# Altium project NXP_FRDM_IMX93.PrjPcb (part 11 of 13)

## Sheet E-20 EXP_MicroSD_ADC.SchDoc: FRDM-IMX93
size 513 x 386 mm; DrawnBy: FORLINX; Organization: ORGANIZATION; Address1: ADDRESS 1; Address2: ADDRESS 2; Address3: ADDRESS 3; Address4: ADDRESS 4; Revision: -; ENG_APP_DATE: --/--/--; DSN_APP_DATE: --/--/--; CHK_APP_DATE: --/--/--; Classification: Public, Company Internal/Proprietary, Company Confidential,  Company Secret; Page Create Date: March  8, 1995; OrgName: NXP Semiconductor; FIUO: A; OrgAddr1: NO. 192 Liangjing Rd. Pudong New Area, ShangHai; Page Number: 20; PageTitle: EXP/MicroSD/ADC; Page Size: C; Page Count: 23; Designer: FORLINX; RevCode: B1; Approver: NXP SE; Doc: SCH-94611 PDF: SPF-94611; DsnPath: T:\FILES\Designs\Single Board Computers\i.MX93-FRDM\Design Files\SCH-94611_B1.DSN; SchematicName: FRDM-i.MX 93 Development Board; PageName: E-20 EXP/MicroSD/ADC; PageSize: C; TopSchematic: True
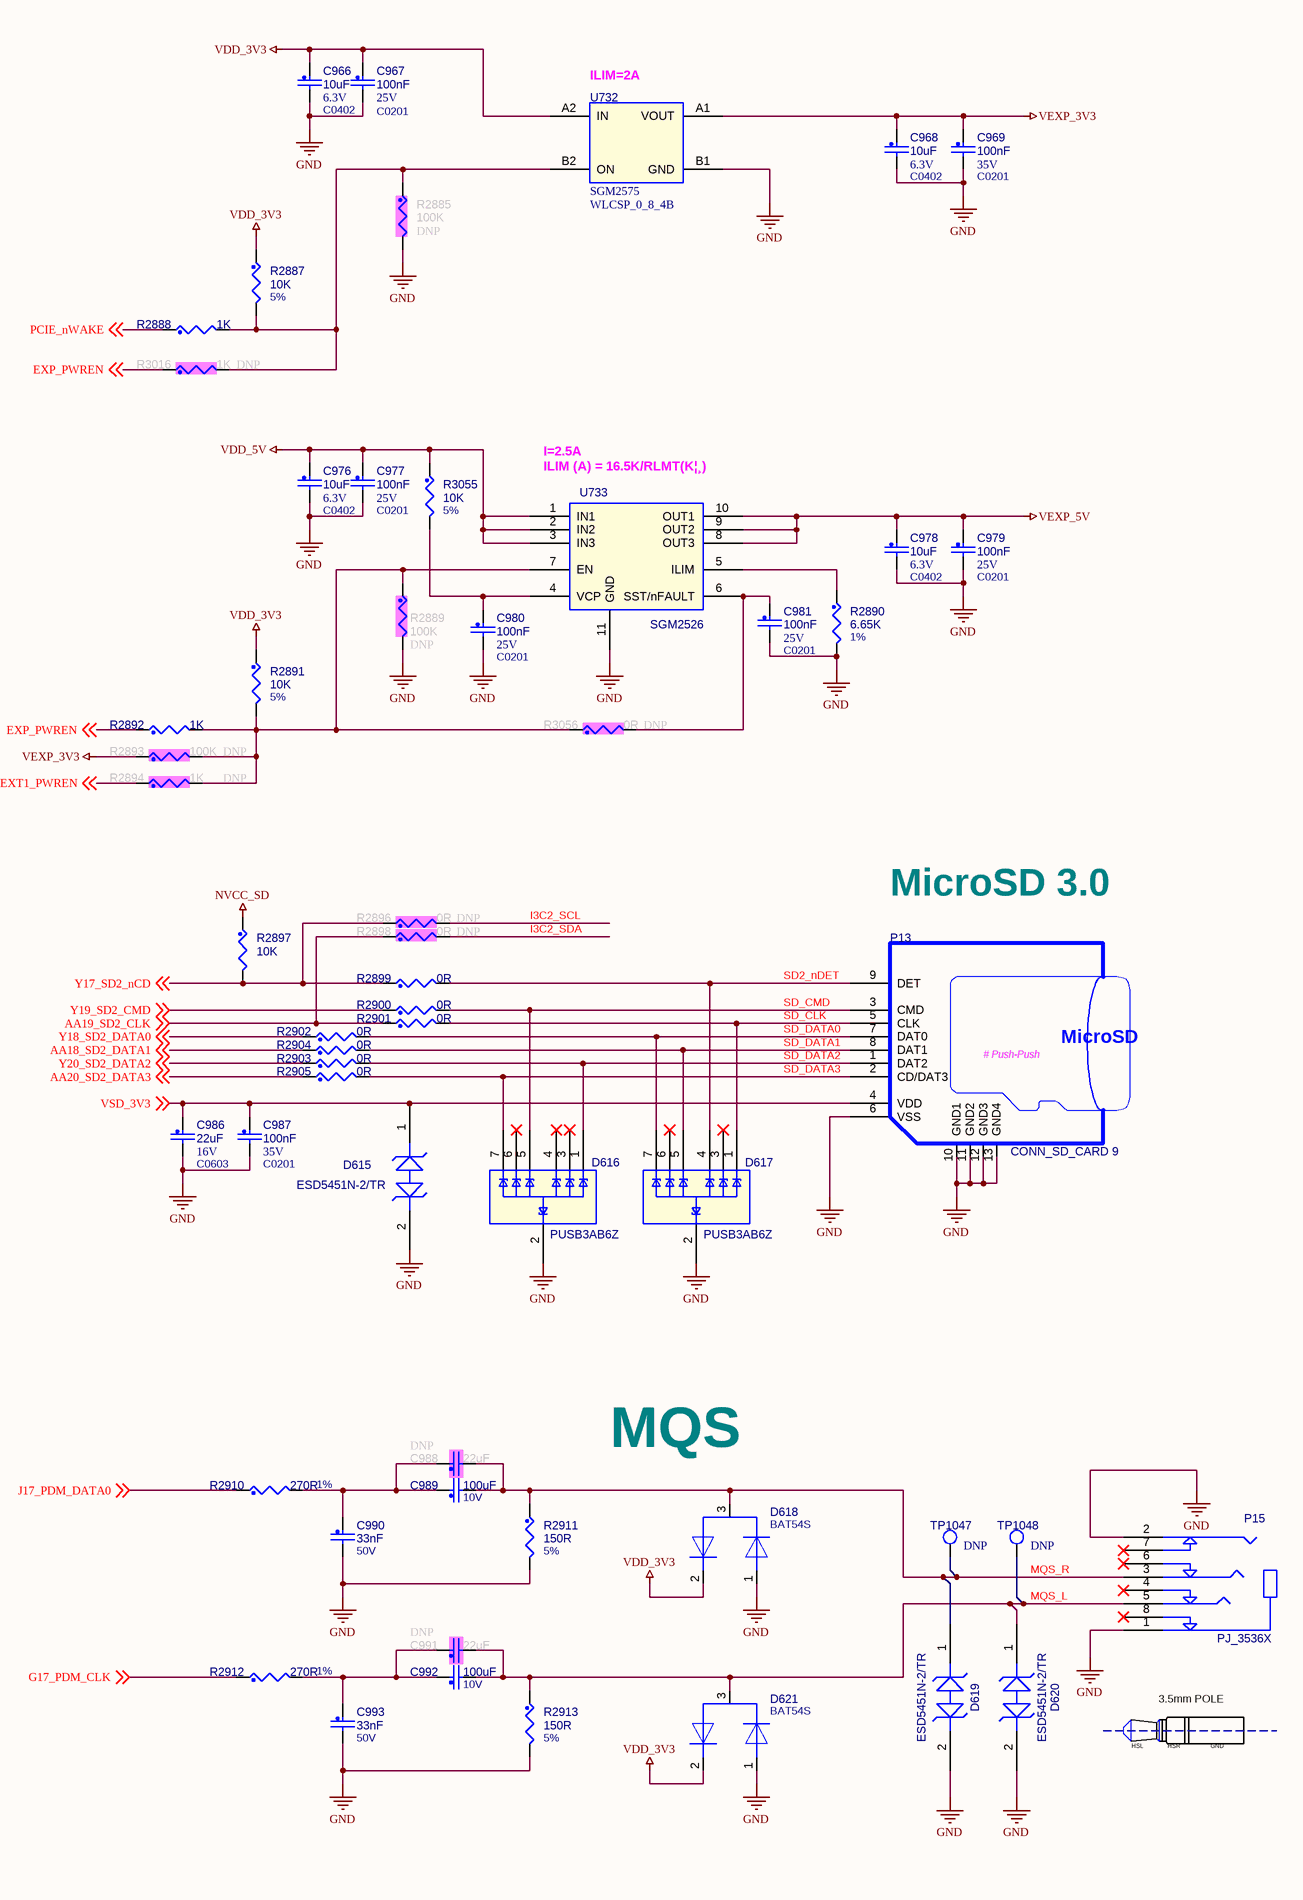
[diagram p35: E-20 EXP_MicroSD_ADC.SchDoc, left]
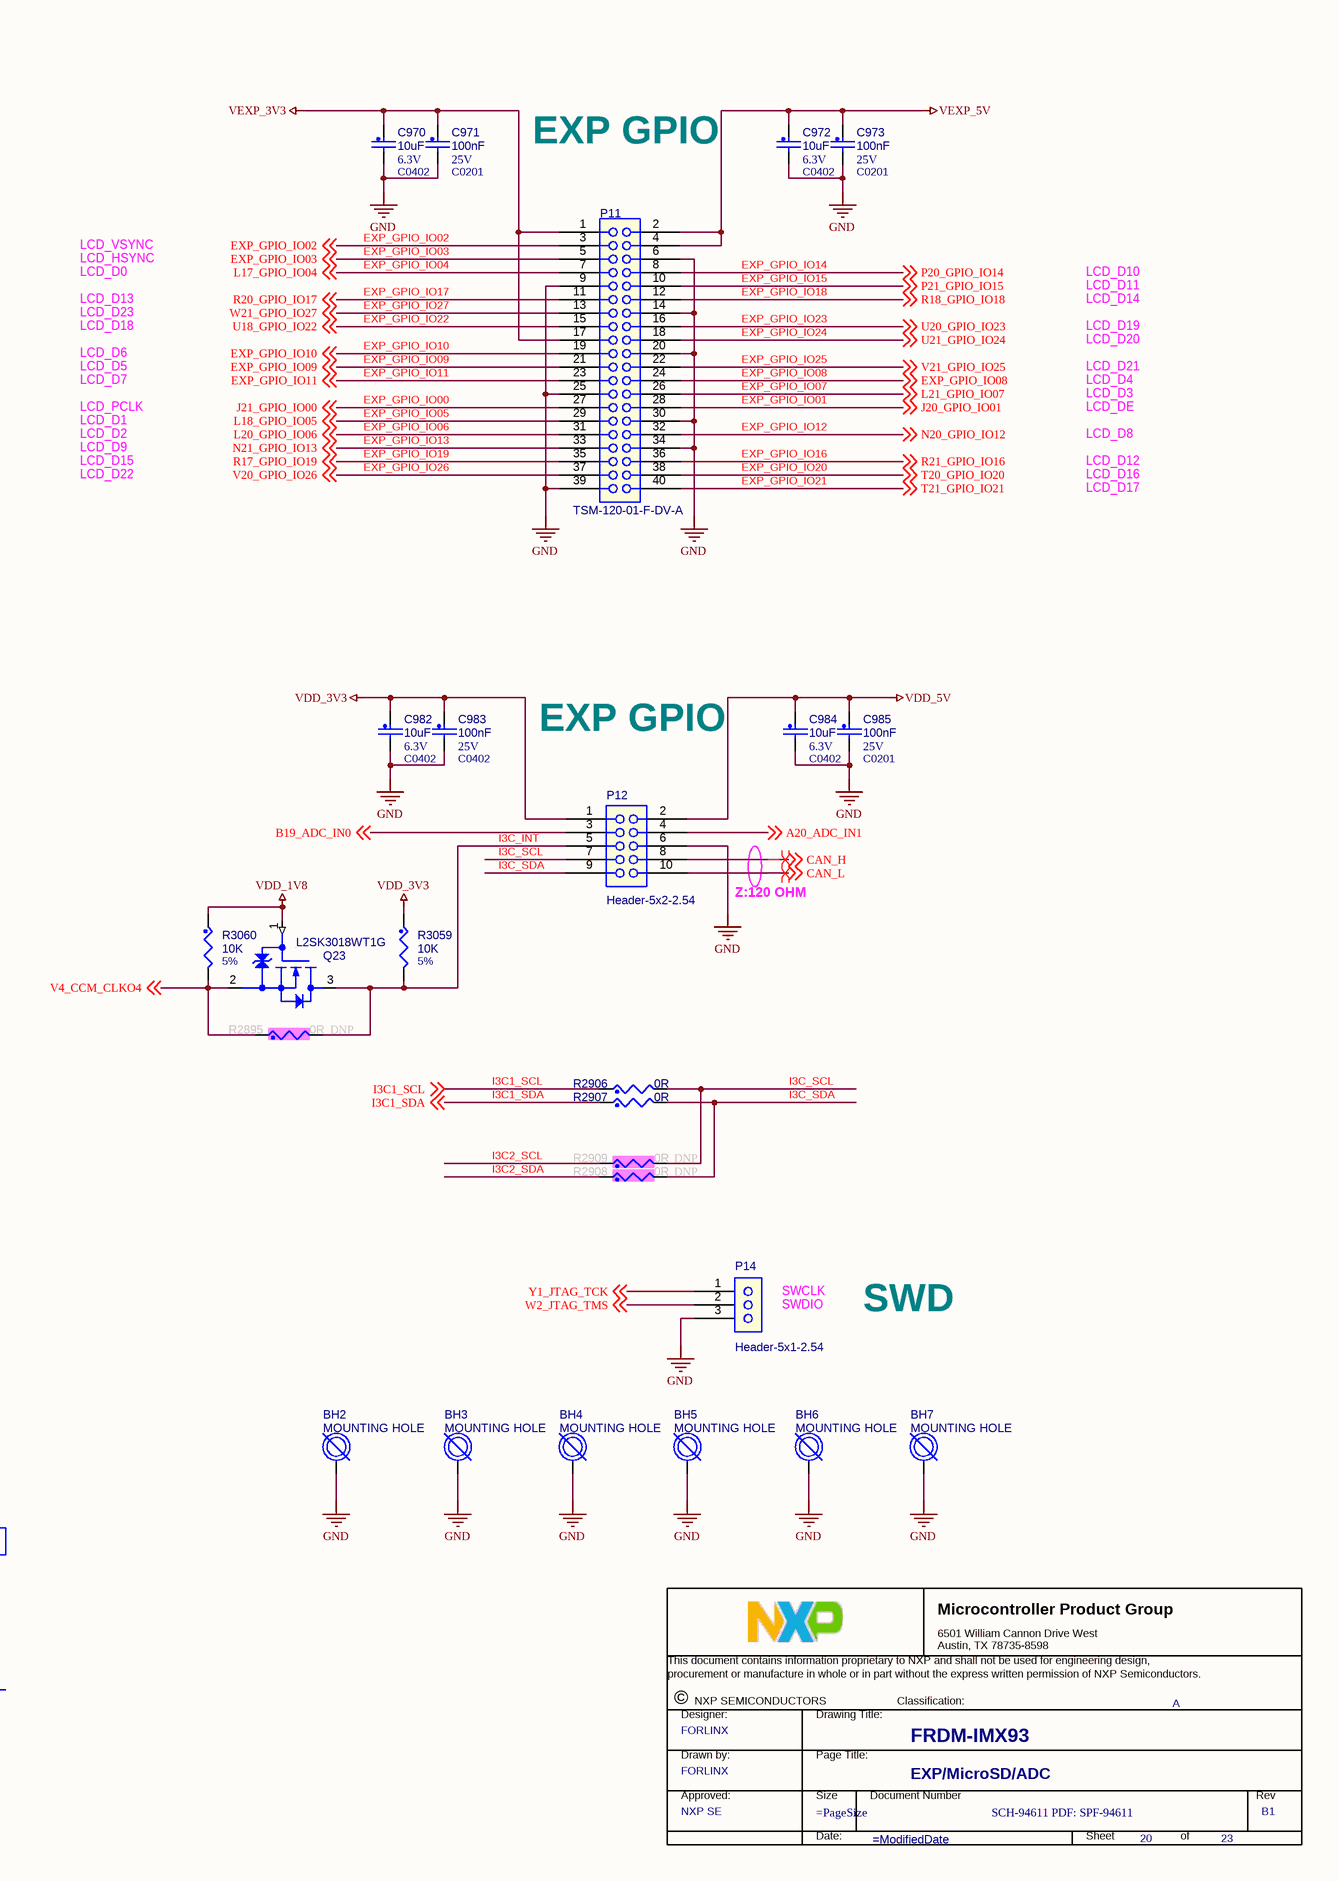
[diagram p36: E-20 EXP_MicroSD_ADC.SchDoc, right]

### Parts
(Parts that share a designator on the sheet are numbered #1, #2 ... from top to bottom, then left to right.)
*#20  Title: FRDM-IMX93  RevCode: B1  PageTitle: EXP/MicroSD/ADC  Page Number: 20  Page Count: 23  DrawnBy: FORLINX  Doc: SCH-94611 PDF: SPF-94611  Approver: NXP SE  FIUO: A  (graphical)
BH2  MOUNTING HOLE  [HOLE2_7_6]
BH3  MOUNTING HOLE  [HOLE2_7_6]
BH4  MOUNTING HOLE  [HOLE2_7_6]
BH5  MOUNTING HOLE  [HOLE2_7_6]
BH6  MOUNTING HOLE  [HOLE2_7_6]
BH7  MOUNTING HOLE  [HOLE2_7_6]
C966  10uF  VOLTAGE: 6.3V  [C0402]
C967  100nF  VOLTAGE: 25V  [C0201]
C968  10uF  VOLTAGE: 6.3V  [C0402]
C969  100nF  VOLTAGE: 35V  [C0201]
C970  10uF  VOLTAGE: 6.3V  [C0402]
C971  100nF  VOLTAGE: 25V  [C0201]
C972  10uF  VOLTAGE: 6.3V  [C0402]
C973  100nF  VOLTAGE: 25V  [C0201]
C976  10uF  VOLTAGE: 6.3V  [C0402]
C977  100nF  VOLTAGE: 25V  [C0201]
C978  10uF  VOLTAGE: 6.3V  [C0402]
C979  100nF  VOLTAGE: 25V  [C0201]
C980  100nF  VOLTAGE: 25V  [C0201]
C981  100nF  VOLTAGE: 25V  [C0201]
C982  10uF  VOLTAGE: 6.3V  [C0402]
C983  100nF  VOLTAGE: 25V  [C0402]
C984  10uF  VOLTAGE: 6.3V  [C0402]
C985  100nF  VOLTAGE: 25V  [C0201]
C986  22uF  VOLTAGE: 16V  [C0603]
C987  100nF  VOLTAGE: 35V  [C0201]
C988  22uF  ASSY_OPT: DNP  [C0805]
C989  100uF  VOLTAGE: 10V  [C1206]
C990  33nF  VOLTAGE: 50V  [C0402]
C991  22uF  ASSY_OPT: DNP  [C0805]
C992  100uF  VOLTAGE: 10V  [C1206]
C993  33nF  VOLTAGE: 50V  [C0402]
D615  ESD5451N-2/TR  [0402TVS]
D616  PUSB3AB6Z  [DFN2111_7]
D617  PUSB3AB6Z  [DFN2111_7]
D618  BAT54S  [sot23_a]
D619  ESD5451N-2/TR  [0402TVS]
D620  ESD5451N-2/TR  [0402TVS]
D621  BAT54S  [sot23_a]
P11  TSM-120-01-F-DV-A  [hdr220_tsm_a_sm]
P12  Header-5x2-2.54  [Header5x2_25]
P13  CONN_SD_CARD 9  [con9_sdcard_1p1mm]
P14  Header-5x1-2.54  [Header_2_54_3p]
P15  PJ_3536X  [PJ3930_8P]
Q23  L2SK3018WT1G  [sc70_3]
R2885  100K  ASSY_OPT: DNP  [R0201]
R2887  10K  Tolerance: 5%  [R0201]
R2888  1K  [R0201]
R2889  100K  ASSY_OPT: DNP  [R0201]
R2890  6.65K  Tolerance: 1%  [R0402]
R2891  10K  Tolerance: 5%  [R0201]
R2892  1K  [R0201]
R2893  100K  ASSY_OPT: DNP  [R0201]
R2894  1K  ASSY_OPT: DNP  [R0201]
R2895  0R  ASSY_OPT: DNP  [R0201]
R2896  0R  ASSY_OPT: DNP  [R0201]
R2897  10K  [R0201]
R2898  0R  ASSY_OPT: DNP  [R0201]
R2899  0R  [R0201]
R2900  0R  [R0201]
R2901  0R  [R0201]
R2902  0R  [R0201]
R2903  0R  [R0201]
R2904  0R  [R0201]
R2905  0R  [R0201]
R2906  0R  [R0201]
R2907  0R  [R0201]
R2908  0R  ASSY_OPT: DNP  [R0201]
R2909  0R  ASSY_OPT: DNP  [R0201]
R2910  270R  Tolerance: 1%  [R0402]
R2911  150R  Tolerance: 5%  [R0402]
R2912  270R  Tolerance: 1%  [R0402]
R2913  150R  Tolerance: 5%  [R0402]
R3016  1K  ASSY_OPT: DNP  [R0201]
R3055  10K  Tolerance: 5%  [R0201]
R3056  0R  ASSY_OPT: DNP  [R0201]
R3059  10K  Tolerance: 5%  [R0201]
R3060  10K  Tolerance: 5%  [R0201]
TP1047  ASSY_OPT: DNP  [tpad_020]  (hidden comment: TPAD_020)
TP1048  ASSY_OPT: DNP  [tpad_020]  (hidden comment: TPAD_020)
U732  SGM2575  [WLCSP_0_8_4B]
U733  SGM2526  [tdfn_3x3_10l]

### Nets
GND: BH2.1 BH3.1 BH4.1 BH5.1 BH6.1 BH7.1 C966.2 C967.2 C968.2 C969.2 C970.2 C971.2 C972.2 C973.2 C976.2 C977.2 C978.2 C979.2 C980.2 C981.2 C982.2 C983.2 C984.2 C985.2 C986.2 C987.2 C990.2 C993.2 D615.2 D616.2 D617.2 D618.1(ANODE) D619.2 D620.2 D621.1(ANODE) P11.6(B3) P11.9(A5) P11.14(B7) P11.20(B10) P11.25(A13) P11.30(B15) P11.34(B17) P11.39(A20) P12.6(B3) P13.6(VSS) P13.10(GND1) P13.11(GND2) P13.12(GND3) P13.13(GND4) P14.3 P15.1 P15.2 R2885.2 R2889.2 R2890.2 R2911.2 R2913.2 U732.B1(GND) U733.11(GND)
NVCC_SD: R2897.1
VDD_1V8: Q23.1(GATE) R3060.1  [project net LPD4/x_VDD1]
VDD_3V3: C966.1 C967.1 C982.1 C983.1 D618.2(CATHODE) D621.2(CATHODE) P12.1(A1) R2887.1 R2891.1 R3059.1 U732.A2(IN)
VDD_5V: C976.1 C977.1 C984.1 C985.1 P12.2(B1) R3055.1 U733.1(IN1) U733.2(IN2) U733.3(IN3)
VEXP_3V3: C968.1 C969.1 C970.1 C971.1 P11.1(A1) P11.17(A9) R2893.1 U732.A1(VOUT)
VEXP_5V: C972.1 C973.1 C978.1 C979.1 P11.2(B1) P11.4(B2) U733.8(OUT3) U733.9(OUT2) U733.10(OUT1)
A20_ADC_IN1: P12.4(B2) ; off-sheet A20_ADC_IN1  [project net ADC_IN1]
AA18_SD2_DATA1: R2904.1 ; off-sheet AA18_SD2_DATA1  [project net SD2_DATA1]
AA19_SD2_CLK: R2898.1 R2901.1 ; off-sheet AA19_SD2_CLK  [project net SD2_CLK]
AA20_SD2_DATA3: R2905.1 ; off-sheet AA20_SD2_DATA3  [project net SD2_DATA3]
B19_ADC_IN0: P12.3(A2) ; off-sheet B19_ADC_IN0  [project net ADC_IN0]
CAN_H: P12.8(B4) ; off-sheet CAN_H
CAN_L: P12.10(B5) ; off-sheet CAN_L
EXP_GPIO_IO00: P11.27(A14) ; off-sheet J21_GPIO_IO00  [also labelled J21_GPIO_IO00]
EXP_GPIO_IO01: P11.28(B14) ; off-sheet J20_GPIO_IO01  [also labelled J20_GPIO_IO01]
EXP_GPIO_IO02: P11.3(A2) ; off-sheet EXP_GPIO_IO02
EXP_GPIO_IO03: P11.5(A3) ; off-sheet EXP_GPIO_IO03
EXP_GPIO_IO04: P11.7(A4) ; off-sheet L17_GPIO_IO04  [also labelled L17_GPIO_IO04]
EXP_GPIO_IO05: P11.29(A15) ; off-sheet L18_GPIO_IO05  [also labelled L18_GPIO_IO05]
EXP_GPIO_IO06: P11.31(A16) ; off-sheet L20_GPIO_IO06  [also labelled L20_GPIO_IO06]
EXP_GPIO_IO07: P11.26(B13) ; off-sheet L21_GPIO_IO07  [also labelled L21_GPIO_IO07]
EXP_GPIO_IO08: P11.24(B12) ; off-sheet EXP_GPIO_IO08
EXP_GPIO_IO09: P11.21(A11) ; off-sheet EXP_GPIO_IO09
EXP_GPIO_IO10: P11.19(A10) ; off-sheet EXP_GPIO_IO10
EXP_GPIO_IO11: P11.23(A12) ; off-sheet EXP_GPIO_IO11
EXP_GPIO_IO12: P11.32(B16) ; off-sheet N20_GPIO_IO12  [also labelled N20_GPIO_IO12]
EXP_GPIO_IO13: P11.33(A17) ; off-sheet N21_GPIO_IO13  [also labelled N21_GPIO_IO13]
EXP_GPIO_IO14: P11.8(B4) ; off-sheet P20_GPIO_IO14  [also labelled P20_GPIO_IO14]
EXP_GPIO_IO15: P11.10(B5) ; off-sheet P21_GPIO_IO15  [also labelled P21_GPIO_IO15]
EXP_GPIO_IO16: P11.36(B18) ; off-sheet R21_GPIO_IO16  [also labelled R21_GPIO_IO16]
EXP_GPIO_IO17: P11.11(A6) ; off-sheet R20_GPIO_IO17  [also labelled R20_GPIO_IO17]
EXP_GPIO_IO18: P11.12(B6) ; off-sheet R18_GPIO_IO18  [also labelled R18_GPIO_IO18]
EXP_GPIO_IO19: P11.35(A18) ; off-sheet R17_GPIO_IO19  [also labelled R17_GPIO_IO19]
EXP_GPIO_IO20: P11.38(B19) ; off-sheet T20_GPIO_IO20  [also labelled T20_GPIO_IO20]
EXP_GPIO_IO21: P11.40(B20) ; off-sheet T21_GPIO_IO21  [also labelled T21_GPIO_IO21]
EXP_GPIO_IO22: P11.15(A8) ; off-sheet U18_GPIO_IO22  [also labelled U18_GPIO_IO22]
EXP_GPIO_IO23: P11.16(B8) ; off-sheet U20_GPIO_IO23  [also labelled U20_GPIO_IO23]
EXP_GPIO_IO24: P11.18(B9) ; off-sheet U21_GPIO_IO24  [also labelled U21_GPIO_IO24]
EXP_GPIO_IO25: P11.22(B11) ; off-sheet V21_GPIO_IO25  [also labelled V21_GPIO_IO25]
EXP_GPIO_IO26: P11.37(A19) ; off-sheet V20_GPIO_IO26  [also labelled V20_GPIO_IO26]
EXP_GPIO_IO27: P11.13(A7) ; off-sheet W21_GPIO_IO27  [also labelled W21_GPIO_IO27]
EXP_PWREN: R2892.1 R3016.1 ; off-sheet EXP_PWREN
EXT1_PWREN: R2894.1 ; off-sheet EXT1_PWREN
G17_PDM_CLK: R2912.1 ; off-sheet G17_PDM_CLK  [project net PDM_CLK]
I3C1_SCL: R2906.1 ; off-sheet I3C1_SCL
I3C1_SDA: R2907.1 ; off-sheet I3C1_SDA
I3C2_SCL: R2896.2 R2909.1
I3C2_SDA: R2898.2 R2908.1
I3C_INT: P12.5(A3) Q23.3(DRAIN) R2895.2 R3059.2
I3C_SCL: P12.7(A4) R2906.2 R2909.2
I3C_SDA: P12.9(A5) R2907.2 R2908.2
J17_PDM_DATA0: R2910.1 ; off-sheet J17_PDM_DATA0  [project net PDM_DATA0]
MQS_L: C991.2 C992.2 D620.1 D621.3(CATHODE/ANODE) P15.5 R2913.1 TP1048.1(TP)
MQS_R: C988.2 C989.2 D618.3(CATHODE/ANODE) D619.1 P15.3 R2911.1 TP1047.1(TP)
PCIE_nWAKE: R2888.1 ; off-sheet PCIE_nWAKE
SD2_nDET: D617.4 P13.9(DET) R2899.2
SD_CLK: D617.1 P13.5(CLK) R2901.2
SD_CMD: D616.5 P13.3(CMD) R2900.2
SD_DATA0: D617.7 P13.7(DAT0) R2902.2
SD_DATA1: D617.5 P13.8(DAT1) R2904.2
SD_DATA2: D616.1 P13.1(DAT2) R2903.2
SD_DATA3: D616.7 P13.2(CD/DAT3) R2905.2
V4_CCM_CLKO4: Q23.2(SOURCE) R2895.1 R3060.2 ; off-sheet V4_CCM_CLKO4  [project net CLKO04]
VSD_3V3: C986.1 C987.1 D615.1 P13.4(VDD) ; off-sheet VSD_3V3
W2_JTAG_TMS: P14.2 ; off-sheet W2_JTAG_TMS  [project net JTAG_TMS]
Y1_JTAG_TCK: P14.1 ; off-sheet Y1_JTAG_TCK  [project net JTAG_TCK]
Y17_SD2_nCD: R2896.1 R2897.2 R2899.1 ; off-sheet Y17_SD2_nCD  [project net SD2_nCD]
Y18_SD2_DATA0: R2902.1 ; off-sheet Y18_SD2_DATA0  [project net SD2_DATA0]
Y19_SD2_CMD: R2900.1 ; off-sheet Y19_SD2_CMD  [project net SD2_CMD]
Y20_SD2_DATA2: R2903.1 ; off-sheet Y20_SD2_DATA2  [project net SD2_DATA2]
NetC980_1: C980.1 R3055.2 U733.4(VCP)
NetC981_1: C981.1 R3056.2 U733.6(SST/nFAULT)
NetC988_1: C988.1 C989.1 C990.1 R2910.2
NetC991_1: C991.1 C992.1 C993.1 R2912.2
NetR2885_1: R2885.1 R2887.2 R2888.2 R3016.2 U732.B2(ON)
NetR2889_1: R2889.1 R2891.2 R2892.2 R2893.2 R2894.2 R3056.1 U733.7(EN)
NetR2890_1: R2890.1 U733.5(ILIM)

Not connected (* = marked no-connect by the designer): D616 3* 4* 6*; D617 3* 6*; P15 4* 6* 7* 8*

### Layout directives
differential pair: CAN_H, CAN_L

### Notes on the sheet
- (near U732) ILIM=2A
- EXP GPIO
- LCD_VSYNC
- LCD_HSYNC
- LCD_D0
- LCD_D13
- LCD_D23
- LCD_D18
- LCD_D10
- LCD_D11
- LCD_D14
- LCD_D19
- LCD_D6
- LCD_D5
- LCD_D7
- LCD_D20
- LCD_D21
- LCD_D4
- LCD_D3
- (near U733) I=2.5A
  ILIM (A) = 16.5K/RLMT(K¦¸)
- LCD_PCLK
- LCD_D1
- LCD_D2
- LCD_D9
- LCD_D15
- LCD_DE
- LCD_D8
- LCD_D12
- LCD_D22
- LCD_D16
- LCD_D17
- MicroSD 3.0
- Z:120 OHM
- (near P13) # Push-Push
- (near P14) SWCLK
- (near P14) SWDIO
- SWD
- MQS
- 3.5mm POLE
- HSL
- HSR
- GND
- DWG. NO.
- REV.
- SHT.
- REVISION
- DESCRIPTION
- DATE
- APPROVED
- ENG:
- APPROVALS
- quilter.ai <http://quilter.ai>
- DSN:
- CHK:
- REFERENCE DOCUMENTS
- TITLE
- PROJECT
- BOM:
- FAB DWG:
- PCB DWG:
- ASSY DWG:
- SIZE
- FILE NAME
- C
- DWG NO.
- SHEET
- OF
- REV
- (in symbol CONN_MICRO_SDCARD) MicroSD
- (in symbol TitleBlock_MCPG) Microcontroller Product Group; 6501 William Cannon Drive West / Austin, TX 78735-8598; This document contains information proprietary to NXP and shall not be used for engineering design,; procurement or manufacture in whole or in part without the express written permission of NXP Semiconductors.; ©; NXP SEMICONDUCTORS; Classification:; Designer:; Drawing Title:; Drawn by:; Page Title:; Approved:; Size; Document Number; Rev; Date:; Sheet; of

### Library data of the parts
*#20 = TitleBlock_MCPG: Classification: Public, Company Internal/Proprietary, Company Confidential,  Company Secret; OrgAddr1: NO. 192 Liangjing Rd. Pudong New Area, ShangHai; OrgName: NXP Semiconductor; Page Size: =PageSize; Page Create Date: March  8, 1995; Designer: FORLINX; Page Modify Date: =ModifiedDate
BH2 = MOUNT_HOLE: no part to order; Part Reference: BH2; CLASS: IC; MFG_NAME01: NOT A COMPONENT; CAD_APPROVED: Yes; Value: MOUNTING HOLE; MFG_PN01: NOT A COMPONENT; ROHS: Yes; HEIGHT: 2.35 MM; PCB Footprint: HOLE2_7_6
BH3 = MOUNT_HOLE: no part to order; Part Reference: BH3; CLASS: IC; CAD_APPROVED: Yes; MFG_PN01: NOT A COMPONENT; Value: MOUNTING HOLE; HEIGHT: 2.35 MM; ROHS: Yes; MFG_NAME01: NOT A COMPONENT; PCB Footprint: HOLE2_7_6
BH4 = MOUNT_HOLE: no part to order; Part Reference: BH4; CLASS: IC; MFG_NAME01: NOT A COMPONENT; CAD_APPROVED: Yes; Value: MOUNTING HOLE; MFG_PN01: NOT A COMPONENT; ROHS: Yes; HEIGHT: 2.35 MM; PCB Footprint: HOLE2_7_6
BH5 = MOUNT_HOLE: no part to order; Part Reference: BH5; CLASS: IC; MFG_NAME01: NOT A COMPONENT; CAD_APPROVED: Yes; Value: MOUNTING HOLE; MFG_PN01: NOT A COMPONENT; ROHS: Yes; HEIGHT: 2.35 MM; PCB Footprint: HOLE2_7_6
BH6 = MOUNT_HOLE: no part to order; Part Reference: BH6; CLASS: IC; CAD_APPROVED: Yes; MFG_PN01: NOT A COMPONENT; Value: MOUNTING HOLE; HEIGHT: 2.35 MM; ROHS: Yes; MFG_NAME01: NOT A COMPONENT; PCB Footprint: HOLE2_7_6
BH7 = MOUNT_HOLE: no part to order; Part Reference: BH7; CLASS: IC; MFG_NAME01: NOT A COMPONENT; CAD_APPROVED: Yes; Value: MOUNTING HOLE; MFG_PN01: NOT A COMPONENT; ROHS: Yes; HEIGHT: 2.35 MM; PCB Footprint: HOLE2_7_6
C966 = CAP_NP: 0402,10uF,6.3V,+/-20%,X5R; Part Reference: C966; CLASS: DISCRETE; LEAD_FREE: YES; Temp_Range: -55¡ãC ~ 85¡ãC; Tolerance: 20%; MFG_NAME01: FENGHUA; MFG_PN01: 0402X106M6R3NT; FPLIST: CC0603_OV,CC0603,0603_CC_NSP; Value: 10uF; ROHS: Yes; CAD_APPROVED: Yes; HEIGHT: 1MM; Package Size: 0603; Package Type: SMD; PCB Footprint: C0402
C967 = CAP_NP: 0201,100nF,25V,+/-10%,X5R; Part Reference: C967; CLASS: DISCRETE; FPLIST: CC0402_25,CC0402_HD,0402_CC,capc0402_l; Tolerance: 10%; CAD_APPROVED: Yes; MFG_NAME01: FENGHUA; MFG_PN01: 0201X104K250NT; Value: 100nF; HEIGHT: 0.55MM; ROHS: Yes; PCB Footprint: C0201
C968 = CAP_NP: 0402,10uF,6.3V,+/-20%,X5R; Part Reference: C968; CLASS: DISCRETE; FPLIST: CC0603_OV,CC0603,0603_CC_NSP; CAD_APPROVED: Yes; MFG_PN01: 0402X106M6R3NT; MFG_NAME01: FENGHUA; Tolerance: 20%; Temp_Range: -55¡ãC ~ 85¡ãC; Value: 10uF; HEIGHT: 1MM; ROHS: Yes; LEAD_FREE: YES; Package Size: 0603; Package Type: SMD; PCB Footprint: C0402
C969 = CAP_NP: 0201,100nF,25V,+/-10%,X5R; Part Reference: C969; CLASS: DISCRETE; Temp Range: -55C to +125C; Rated Voltage: 50V; TOL: 10%; FPLIST: CC0402_25,CC0402_HD,0402_CC,capc0402_l; CAD_APPROVED: Yes; MFG_PN01: 0201X104K250NT; MFG_NAME01: FENGHUA; EN: 102-1-02300; Value: 100nF; HEIGHT: 0.6 MM; ROHS: Yes; Tolerance: 10%; PCB Footprint: C0201
C970 = CAP_NP: 0402,10uF,6.3V,+/-20%,X5R; Part Reference: C970; CLASS: DISCRETE; FPLIST: CC0603_OV,CC0603,0603_CC_NSP; CAD_APPROVED: Yes; MFG_PN01: 0402X106M6R3NT; MFG_NAME01: FENGHUA; Tolerance: 20%; Temp_Range: -55¡ãC ~ 85¡ãC; Value: 10uF; Package Type: SMD; Package Size: 0603; HEIGHT: 1MM; ROHS: Yes; LEAD_FREE: YES; PCB Footprint: C0402
C971 = CAP_NP: 0201,100nF,25V,+/-10%,X5R; Part Reference: C971; CLASS: DISCRETE; FPLIST: CC0402_25,CC0402_HD,0402_CC,capc0402_l; Tolerance: 10%; CAD_APPROVED: Yes; MFG_NAME01: FENGHUA; MFG_PN01: 0201X104K250NT; Value: 100nF; HEIGHT: 0.55MM; ROHS: Yes; PCB Footprint: C0201
C972 = CAP_NP: 0402,10uF,6.3V,+/-20%,X5R; Part Reference: C972; CLASS: DISCRETE; FPLIST: CC0603_OV,CC0603,0603_CC_NSP; CAD_APPROVED: Yes; MFG_PN01: 0402X106M6R3NT; MFG_NAME01: FENGHUA; Tolerance: 20%; Temp_Range: -55¡ãC ~ 85¡ãC; Value: 10uF; HEIGHT: 1MM; ROHS: Yes; LEAD_FREE: YES; Package Size: 0603; Package Type: SMD; PCB Footprint: C0402
C973 = CAP_NP: 0201,100nF,25V,+/-10%,X5R; Part Reference: C973; CLASS: DISCRETE; MFG_PN01: 0201X104K250NT; MFG_NAME01: FENGHUA; CAD_APPROVED: Yes; Tolerance: 10%; FPLIST: CC0402_25,CC0402_HD,0402_CC,capc0402_l; Value: 100nF; ROHS: Yes; HEIGHT: 0.55MM; PCB Footprint: C0201
C976 = CAP_NP: 0402,10uF,6.3V,+/-20%,X5R; Part Reference: C976; CLASS: DISCRETE; FPLIST: CC0603_OV,CC0603,0603_CC_NSP; CAD_APPROVED: Yes; MFG_PN01: 0402X106M6R3NT; MFG_NAME01: FENGHUA; Tolerance: 20%; Temp_Range: -55¡ãC ~ 85¡ãC; Value: 10uF; Package Type: SMD; Package Size: 0603; HEIGHT: 1MM; ROHS: Yes; LEAD_FREE: YES; PCB Footprint: C0402
C977 = CAP_NP: 0201,100nF,25V,+/-10%,X5R; Part Reference: C977; CLASS: DISCRETE; MFG_PN01: 0201X104K250NT; MFG_NAME01: FENGHUA; CAD_APPROVED: Yes; Tolerance: 10%; FPLIST: CC0402_25,CC0402_HD,0402_CC,capc0402_l; Value: 100nF; ROHS: Yes; HEIGHT: 0.55MM; PCB Footprint: C0201
C978 = CAP_NP: 0402,10uF,6.3V,+/-20%,X5R; Part Reference: C978; CLASS: DISCRETE; LEAD_FREE: YES; Temp_Range: -55¡ãC ~ 85¡ãC; Tolerance: 20%; MFG_NAME01: FENGHUA; MFG_PN01: 0402X106M6R3NT; FPLIST: CC0603_OV,CC0603,0603_CC_NSP; Value: 10uF; Package Type: SMD; Package Size: 0603; ROHS: Yes; CAD_APPROVED: Yes; HEIGHT: 1MM; PCB Footprint: C0402
C979 = CAP_NP: 0201,100nF,25V,+/-10%,X5R; Part Reference: C979; CLASS: DISCRETE; Temp Range: -55C to +125C; Rated Voltage: 50V; TOL: 10%; FPLIST: CC0402_25,CC0402_HD,0402_CC,capc0402_l; CAD_APPROVED: Yes; MFG_PN01: 0201X104K250NT; MFG_NAME01: FENGHUA; EN: 102-1-02300; Value: 100nF; HEIGHT: 0.6 MM; ROHS: Yes; Tolerance: 10%; PCB Footprint: C0201
C980 = CAP_NP: 0201,100nF,25V,+/-10%,X5R; Part Reference: C980; CLASS: DISCRETE; EN: 102-1-02300; Tolerance: 10%; MFG_NAME01: FENGHUA; MFG_PN01: 0201X104K250NT; CAD_APPROVED: Yes; FPLIST: CC0402_25,CC0402_HD,0402_CC,capc0402_l; Rated Voltage: 50V; Temp Range: -55C to +125C; Value: 100nF; ROHS: Yes; HEIGHT: 0.6 MM; TOL: 10%; PCB Footprint: C0201
C981 = CAP_NP: 0201,100nF,25V,+/-10%,X5R; Part Reference: C981; CLASS: DISCRETE; Temp Range: -55C to +125C; Rated Voltage: 50V; TOL: 10%; FPLIST: CC0402_25,CC0402_HD,0402_CC,capc0402_l; CAD_APPROVED: Yes; MFG_PN01: 0201X104K250NT; MFG_NAME01: FENGHUA; EN: 102-1-02300; Value: 100nF; HEIGHT: 0.6 MM; ROHS: Yes; Tolerance: 10%; PCB Footprint: C0201
C982 = CAP_NP: 0402,10uF,6.3V,+/-20%,X5R; Part Reference: C982; CLASS: DISCRETE; LEAD_FREE: YES; Temp_Range: -55¡ãC ~ 85¡ãC; Tolerance: 20%; MFG_NAME01: FENGHUA; MFG_PN01: 0402X106M6R3NT; FPLIST: CC0603_OV,CC0603,0603_CC_NSP; Value: 10uF; ROHS: Yes; CAD_APPROVED: Yes; HEIGHT: 1MM; Package Size: 0603; Package Type: SMD; PCB Footprint: C0402
C983 = CAP_NP: 0402,100nF,50V,+/-10%,X5R; Part Reference: C983; CLASS: DISCRETE; FPLIST: CC0402_25,CC0402_HD,0402_CC,capc0402_l; Tolerance: 10%; CAD_APPROVED: Yes; MFG_NAME01: FENGHUA; MFG_PN01: 0402X104K500NT; Value: 100nF; HEIGHT: 0.55MM; ROHS: Yes; PCB Footprint: C0402
C984 = CAP_NP: 0402,10uF,6.3V,+/-20%,X5R; Part Reference: C984; CLASS: DISCRETE; FPLIST: CC0603_OV,CC0603,0603_CC_NSP; CAD_APPROVED: Yes; MFG_PN01: 0402X106M6R3NT; MFG_NAME01: FENGHUA; Tolerance: 20%; Temp_Range: -55¡ãC ~ 85¡ãC; Value: 10uF; HEIGHT: 1MM; ROHS: Yes; LEAD_FREE: YES; Package Size: 0603; Package Type: SMD; PCB Footprint: C0402
C985 = CAP_NP: 0201,100nF,25V,+/-10%,X5R; Part Reference: C985; CLASS: DISCRETE; MFG_PN01: 0201X104K250NT; MFG_NAME01: FENGHUA; CAD_APPROVED: Yes; Tolerance: 10%; FPLIST: CC0402_25,CC0402_HD,0402_CC,capc0402_l; Value: 100nF; ROHS: Yes; HEIGHT: 0.55MM; PCB Footprint: C0201
C986 = CAP_NP: 0603,22uF,6.3V,+/-20%,X5R; Part Reference: C986; CLASS: DISCRETE; MFG_PN01: CL10A226MQ8NRNC; MFG_NAME01: SAMSUNG; CAD_APPROVED: Yes; Tolerance: 20%; FPLIST: CC0805_OV,CC0805,0805_CC; Value: 22uF; ROHS: Yes; HEIGHT: 1.45MM; PCB Footprint: C0603
C987 = CAP_NP: 0201,100nF,25V,+/-10%,X5R; Part Reference: C987; CLASS: DISCRETE; Tolerance: 10%; MFG_NAME01: FENGHUA; MFG_PN01: 0201X104K250NT; CAD_APPROVED: Yes; FPLIST: CC0402_25,CC0402_HD,0402_CC,capc0402_l; Value: 100nF; ROHS: Yes; HEIGHT: 0.55MM; PCB Footprint: C0201
C988 = CAP_NP: 0805,22uF,25V,+/-20%,X5R; Part Reference: C988; CLASS: DISCRETE; FPLIST: CC0805_OV,CC0805,0805_CC; Tolerance: 20%; CAD_APPROVED: Yes; MFG_NAME01: MURATA; MFG_PN01: GRM21BR61E226ME44L; Value: 22uF; HEIGHT: 1.45MM; ROHS: Yes; PCB Footprint: C0805
C989 = CAP_NP: 1206,100uF,6.3V,+/-20%,X5R; Part Reference: C989; CLASS: DISCRETE; MFG_PN01: CL31A107MQHNNNE; MFG_NAME01: SAMSUNG; CAD_APPROVED: Yes; Tolerance: 20%; FPLIST: CC1206_OV,CC1206,1206_CC; Value: 100uF; ROHS: Yes; HEIGHT: 1.9MM; PCB Footprint: C1206
C990 = CAP_NP: 0402,33nF,50V,+/-10%,X7R; Part Reference: C990; CLASS: DISCRETE; MFG_PN01: 0402B333K500NT; MFG_NAME01: FENGHUA; CAD_APPROVED: Yes; Tolerance: 10%; FPLIST: CC0402_25,CC0402_HD,0402_CC,capc0402_l; Value: 33nF; ROHS: Yes; Package Type: SMD; HEIGHT: 0.55MM; Package Size: 0402; PCB Footprint: C0402
C991 = CAP_NP: 0805,22uF,25V,+/-20%,X5R; Part Reference: C991; CLASS: DISCRETE; MFG_PN01: GRM21BR61E226ME44L; MFG_NAME01: MURATA; CAD_APPROVED: Yes; Tolerance: 20%; FPLIST: CC0805_OV,CC0805,0805_CC; Value: 22uF; ROHS: Yes; HEIGHT: 1.45MM; PCB Footprint: C0805
C992 = CAP_NP: 1206,100uF,6.3V,+/-20%,X5R; Part Reference: C992; CLASS: DISCRETE; MFG_PN01: CL31A107MQHNNNE; MFG_NAME01: SAMSUNG; CAD_APPROVED: Yes; Tolerance: 20%; FPLIST: CC1206_OV,CC1206,1206_CC; Value: 100uF; ROHS: Yes; HEIGHT: 1.9MM; PCB Footprint: C1206
C993 = CAP_NP: 0402,33nF,50V,+/-10%,X7R; Part Reference: C993; CLASS: DISCRETE; FPLIST: CC0402_25,CC0402_HD,0402_CC,capc0402_l; Tolerance: 10%; CAD_APPROVED: Yes; MFG_NAME01: FENGHUA; MFG_PN01: 0402B333K500NT; Value: 33nF; Package Size: 0402; HEIGHT: 0.55MM; Package Type: SMD; ROHS: Yes; PCB Footprint: C0402
D615 = ESD5451N-2/TR: Part Reference: D615; MFG_NAME01: WILLSEMI; Value: ESD5451N-2/TR; MFG_PN01: ESD5451N-2/TR; PCB Footprint: 0402TVS
D616 = PUSB3AB6Z: Part Reference: D616; MFG_NAME01: Nexperia; Value: PUSB3AB6Z; MFG_PN01: PUSB3AB6Z; PCB Footprint: DFN2111_7
D617 = PUSB3AB6Z: Part Reference: D617; MFG_NAME01: Nexperia; Value: PUSB3AB6Z; MFG_PN01: PUSB3AB6Z; PCB Footprint: DFN2111_7
D618 = BAV99W: BAT54S,SOT-23-3; Part Reference: D618; CLASS: IC; MFG_NAME01: FDM; Rated Voltage: 100V; Value: BAT54S; MFG_PN01: BAT54S; PCB Footprint: sot23_a
D619 = ESD5451N-2/TR: Part Reference: D619; MFG_NAME01: WILLSEMI; Value: ESD5451N-2/TR; MFG_PN01: ESD5451N-2/TR; PCB Footprint: 0402TVS
D620 = ESD5451N-2/TR: Part Reference: D620; MFG_NAME01: WILLSEMI; Value: ESD5451N-2/TR; MFG_PN01: ESD5451N-2/TR; PCB Footprint: 0402TVS
D621 = BAV99W: BAT54S,SOT-23-3; Part Reference: D621; CLASS: IC; MFG_NAME01: FDM; Rated Voltage: 100V; Value: BAT54S; MFG_PN01: BAT54S; PCB Footprint: sot23_a
P11 = CONN_HDR_19: Double row, 2 * 20P, 2.54mm, S, gold-plated, green; Part Reference: P11; CLASS: IO; 3D_Mechanical_Footprint_File: ftp://fcl.am.freescale.net/ALLEGRO/step/hdr220_tsm_a_sm.step; MFG_PN01: 2*20P-2.54mm-S; MFG_NAME01: Jiln; Temp Range: -55¡ãC ~ 125¡ãC; CAD_APPROVED: Yes; Value: TSM-120-01-F-DV-A; ROHS: Yes; HEIGHT: 10.03MM; PCB Footprint: hdr220_tsm_a_sm
P12 = Header-5x2-2_0.54: Double row,2*5P,2.54mm,S; Part Reference: P12; MFG_NAME01: Jiln; MFG_PN01: 2*5P-2.54mm-S; Value: Header-5x2-2.54; PCB Footprint: Header5x2_25
P13 = CONN_MICRO_SDCARD: TFP09-2-12B; Part Reference: P13; CLASS: IO; MFG_NAME01: TIANMAI; CAD_APPROVED: Yes; Value: CONN_SD_CARD 9; MFG_PN01: TFP09-2-12B; ROHS: Yes; Package Type: SMT; HEIGHT: 2.05 MM; PCB Footprint: con9_sdcard_1p1mm
P14 = Header-5x1-2_0.54: Single row,3P,2.54mm,S; Part Reference: P14; MFG_NAME01: Jiln; MFG_PN01: 3P-2.54mm-S; Value: Header-5x1-2.54; PCB Footprint: Header_2_54_3p
P15 = PJ_3536X: PJ3930-8P,3.5mm,Level 4; Part Reference: P15; MFG_NAME01: HONGSHENGLONG; Value: PJ_3536X; MFG_PN01: PJ3930-8P; PCB Footprint: PJ3930_8P
Q23 = NX3008NBKW_SOT323: Part Reference: Q23; CLASS: IC; MFG_NAME01: LRC; CAD_APPROVED: Yes; Value: L2SK3018WT1G; MFG_PN01: L2SK3018WT1G; ROHS: Yes; HEIGHT: 1.1MM; PCB Footprint: sc70_3
R2885 = RES: 0201,100K,+/-1%; Part Reference: R2885; CLASS: DISCRETE; MFG_PN01: RC-01W1003FT; MFG_NAME01: FENGHUA; Temp Range: -55¡ãC ~ 155¡ãC; CAD_APPROVED: Yes; Tolerance: 1%; FPLIST: RC0402_25,RC0402_HD,0402_CC; Value: 100K; ROHS: Yes; HEIGHT: 0.4 MM; PCB Footprint: R0201
R2887 = RES: 0201,10K,+/-5%; Part Reference: R2887; CLASS: DISCRETE; MFG_NAME01: FENGHUA; MFG_PN01: RC-01W103JT; CAD_APPROVED: Yes; FPLIST: RC0402_25,RC0402_HD,0402_CC; Value: 10K; ROHS: Yes; HEIGHT: 0.4 MM; PCB Footprint: R0201
R2888 = RES: 0201,1K,+/-1%; Part Reference: R2888; CLASS: DISCRETE; VOLTAGE: 1/16W; FPLIST: RC0402_25,RC0402_HD,RC0402_X2,0402_CC; CAD_APPROVED: Yes; MFG_PN01: RC-01W1001FT; MFG_NAME01: FENGHUA; Tolerance: 5%; Value: 1K; ROHS: Yes; HEIGHT: 0.45 MM; PCB Footprint: R0201
R2889 = RES: 0201,100K,+/-1%; Part Reference: R2889; CLASS: DISCRETE; FPLIST: RC0402_25,RC0402_HD,0402_CC; Tolerance: 1%; CAD_APPROVED: Yes; Temp Range: -55¡ãC ~ 155¡ãC; MFG_NAME01: FENGHUA; MFG_PN01: RC-01W1003FT; Value: 100K; HEIGHT: 0.4 MM; ROHS: Yes; PCB Footprint: R0201
R2890 = RES: 0402,6.65K,+/-1%; Part Reference: R2890; CLASS: DISCRETE; FPLIST: RC0402_25,RC0402_HD,0402_CC; CAD_APPROVED: Yes; Temp Range: -55¡ãC ~ 155¡ãC; MFG_NAME01: FENGHUA; MFG_PN01: RC-02W6651FT; Value: 6.65K; HEIGHT: 0.4 MM; ROHS: Yes; PCB Footprint: R0402
R2891 = RES: 0201,10K,+/-5%; Part Reference: R2891; CLASS: DISCRETE; MFG_NAME01: FENGHUA; MFG_PN01: RC-01W103JT; CAD_APPROVED: Yes; FPLIST: RC0402_25,RC0402_HD,0402_CC; Value: 10K; ROHS: Yes; HEIGHT: 0.4 MM; PCB Footprint: R0201
R2892 = RES: 0201,1K,+/-1%; Part Reference: R2892; CLASS: DISCRETE; VOLTAGE: 1/16W; FPLIST: RC0402_25,RC0402_HD,RC0402_X2,0402_CC; CAD_APPROVED: Yes; MFG_PN01: RC-01W1001FT; MFG_NAME01: FENGHUA; Tolerance: 5%; Value: 1K; ROHS: Yes; HEIGHT: 0.45 MM; PCB Footprint: R0201
R2893 = RES: 0201,100K,+/-1%; Part Reference: R2893; CLASS: DISCRETE; VOLTAGE: 1/16W; FPLIST: RC0402_25,RC0402_HD,RC0402_X2,0402_CC; CAD_APPROVED: Yes; MFG_PN01: RC-01W1003FT; MFG_NAME01: FENGHUA; Tolerance: 5%; Value: 100K; ROHS: Yes; HEIGHT: 0.45 MM; PCB Footprint: R0201
R2894 = RES: 0201,1K,+/-1%; Part Reference: R2894; CLASS: DISCRETE; VOLTAGE: 1/16W; FPLIST: RC0402_25,RC0402_HD,RC0402_X2,0402_CC; CAD_APPROVED: Yes; MFG_PN01: RC-01W1001FT; MFG_NAME01: FENGHUA; Tolerance: 5%; Value: 1K; ROHS: Yes; HEIGHT: 0.45 MM; PCB Footprint: R0201
R2895 = RES: 0201,0Ohm,+/-5%; Part Reference: R2895; CLASS: DISCRETE; VOLTAGE: 1/16W; FPLIST: RC0402_25,RC0402_HD,RC0402_X2,0402_CC; CAD_APPROVED: Yes; MFG_PN01: RC-01000JT; MFG_NAME01: FENGHUA; Tolerance: 5%; Value: 0R; ROHS: Yes; HEIGHT: 0.45 MM; PCB Footprint: R0201
R2896 = RES: 0201,0Ohm,+/-5%; Part Reference: R2896; CLASS: DISCRETE; Tolerance: 5%; MFG_NAME01: FENGHUA; MFG_PN01: RC-01000JT; CAD_APPROVED: Yes; FPLIST: RC0402_25,RC0402_HD,RC0402_X2,0402_CC; VOLTAGE: 1/16W; Value: 0R; HEIGHT: 0.45 MM; ROHS: Yes; PCB Footprint: R0201
R2897 = RES: 0201,10K,+/-5%; Part Reference: R2897; CLASS: DISCRETE; FPLIST: RC0402_25,RC0402_HD,0402_CC; CAD_APPROVED: Yes; MFG_PN01: RC-01W103JT; MFG_NAME01: FENGHUA; Tolerance: 5%; Value: 10K; HEIGHT: 0.4 MM; ROHS: Yes; PCB Footprint: R0201
R2898 = RES: 0201,0Ohm,+/-5%; Part Reference: R2898; CLASS: DISCRETE; Tolerance: 5%; MFG_NAME01: FENGHUA; MFG_PN01: RC-01000JT; CAD_APPROVED: Yes; FPLIST: RC0402_25,RC0402_HD,RC0402_X2,0402_CC; VOLTAGE: 1/16W; Value: 0R; HEIGHT: 0.45 MM; ROHS: Yes; PCB Footprint: R0201
R2899 = RES: 0201,0Ohm,+/-5%; Part Reference: R2899; CLASS: DISCRETE; Tolerance: 5%; MFG_NAME01: FENGHUA; MFG_PN01: RC-01000JT; CAD_APPROVED: Yes; FPLIST: RC0402_25,RC0402_HD,RC0402_X2,0402_CC; VOLTAGE: 1/16W; Value: 0R; HEIGHT: 0.45 MM; ROHS: Yes; PCB Footprint: R0201
R2900 = RES: 0201,0Ohm,+/-5%; Part Reference: R2900; CLASS: DISCRETE; VOLTAGE: 1/16W; FPLIST: RC0402_25,RC0402_HD,RC0402_X2,0402_CC; CAD_APPROVED: Yes; MFG_PN01: RC-01000JT; MFG_NAME01: FENGHUA; Tolerance: 5%; Value: 0R; ROHS: Yes; HEIGHT: 0.45 MM; PCB Footprint: R0201
R2901 = RES: 0201,0Ohm,+/-5%; Part Reference: R2901; CLASS: DISCRETE; VOLTAGE: 1/16W; FPLIST: RC0402_25,RC0402_HD,RC0402_X2,0402_CC; CAD_APPROVED: Yes; MFG_PN01: RC-01000JT; MFG_NAME01: FENGHUA; Tolerance: 5%; Value: 0R; ROHS: Yes; HEIGHT: 0.45 MM; PCB Footprint: R0201
R2902 = RES: 0201,0Ohm,+/-5%; Part Reference: R2902; CLASS: DISCRETE; VOLTAGE: 1/16W; FPLIST: RC0402_25,RC0402_HD,RC0402_X2,0402_CC; CAD_APPROVED: Yes; MFG_PN01: RC-01000JT; MFG_NAME01: FENGHUA; Tolerance: 5%; Value: 0R; ROHS: Yes; HEIGHT: 0.45 MM; PCB Footprint: R0201
R2903 = RES: 0201,0Ohm,+/-5%; Part Reference: R2903; CLASS: DISCRETE; Tolerance: 5%; MFG_NAME01: FENGHUA; MFG_PN01: RC-01000JT; CAD_APPROVED: Yes; FPLIST: RC0402_25,RC0402_HD,RC0402_X2,0402_CC; VOLTAGE: 1/16W; Value: 0R; HEIGHT: 0.45 MM; ROHS: Yes; PCB Footprint: R0201
R2904 = RES: 0201,0Ohm,+/-5%; Part Reference: R2904; CLASS: DISCRETE; Tolerance: 5%; MFG_NAME01: FENGHUA; MFG_PN01: RC-01000JT; CAD_APPROVED: Yes; FPLIST: RC0402_25,RC0402_HD,RC0402_X2,0402_CC; VOLTAGE: 1/16W; Value: 0R; HEIGHT: 0.45 MM; ROHS: Yes; PCB Footprint: R0201
R2905 = RES: 0201,0Ohm,+/-5%; Part Reference: R2905; CLASS: DISCRETE; VOLTAGE: 1/16W; FPLIST: RC0402_25,RC0402_HD,RC0402_X2,0402_CC; CAD_APPROVED: Yes; MFG_PN01: RC-01000JT; MFG_NAME01: FENGHUA; Tolerance: 5%; Value: 0R; ROHS: Yes; HEIGHT: 0.45 MM; PCB Footprint: R0201
R2906 = RES: 0201,0Ohm,+/-5%; Part Reference: R2906; CLASS: DISCRETE; VOLTAGE: 1/16W; FPLIST: RC0402_25,RC0402_HD,RC0402_X2,0402_CC; CAD_APPROVED: Yes; MFG_PN01: RC-01000JT; MFG_NAME01: FENGHUA; Tolerance: 5%; Value: 0R; ROHS: Yes; HEIGHT: 0.45 MM; PCB Footprint: R0201
R2907 = RES: 0201,0Ohm,+/-5%; Part Reference: R2907; CLASS: DISCRETE; VOLTAGE: 1/16W; FPLIST: RC0402_25,RC0402_HD,RC0402_X2,0402_CC; CAD_APPROVED: Yes; MFG_PN01: RC-01000JT; MFG_NAME01: FENGHUA; Tolerance: 5%; Value: 0R; ROHS: Yes; HEIGHT: 0.45 MM; PCB Footprint: R0201
R2908 = RES: 0201,0Ohm,+/-5%; Part Reference: R2908; CLASS: DISCRETE; Tolerance: 5%; MFG_NAME01: FENGHUA; MFG_PN01: RC-01000JT; CAD_APPROVED: Yes; FPLIST: RC0402_25,RC0402_HD,RC0402_X2,0402_CC; VOLTAGE: 1/16W; Value: 0R; HEIGHT: 0.45 MM; ROHS: Yes; PCB Footprint: R0201
R2909 = RES: 0201,0Ohm,+/-5%; Part Reference: R2909; CLASS: DISCRETE; Tolerance: 5%; MFG_NAME01: FENGHUA; MFG_PN01: RC-01000JT; CAD_APPROVED: Yes; FPLIST: RC0402_25,RC0402_HD,RC0402_X2,0402_CC; VOLTAGE: 1/16W; Value: 0R; HEIGHT: 0.45 MM; ROHS: Yes; PCB Footprint: R0201
R2910 = RES: 0402,270Ohm,+/-5%; Part Reference: R2910; CLASS: DISCRETE; MFG_PN01: RC-02W271JT; MFG_NAME01: FENGHUA; Temp Range: -55¡ãC to +155¡ãC; VOLTAGE: 50V; CAD_APPROVED: Yes; FPLIST: RC0402_25,RC0402_HD,0402_CC; Value: 270R; ROHS: Yes; HEIGHT: 0.4MM; PCB Footprint: R0402
R2911 = RES: 0402,150Ohm,+/-5%; Part Reference: R2911; CLASS: DISCRETE; MFG_PN01: RC-02W151JT; MFG_NAME01: FENGHUA; VOLTAGE: 1/16W; CAD_APPROVED: Yes; FPLIST: RC0402_25,RC0402_HD,0402_CC; Value: 150R; ROHS: Yes; HEIGHT: 0.40 MM; PCB Footprint: R0402
R2912 = RES: 0402,270Ohm,+/-5%; Part Reference: R2912; CLASS: DISCRETE; FPLIST: RC0402_25,RC0402_HD,0402_CC; CAD_APPROVED: Yes; VOLTAGE: 50V; Temp Range: -55¡ãC to +155¡ãC; MFG_NAME01: FENGHUA; MFG_PN01: RC-02W271JT; Value: 270R; HEIGHT: 0.4MM; ROHS: Yes; PCB Footprint: R0402
R2913 = RES: 0402,150Ohm,+/-5%; Part Reference: R2913; CLASS: DISCRETE; FPLIST: RC0402_25,RC0402_HD,0402_CC; CAD_APPROVED: Yes; VOLTAGE: 1/16W; MFG_NAME01: FENGHUA; MFG_PN01: RC-02W151JT; Value: 150R; HEIGHT: 0.40 MM; ROHS: Yes; PCB Footprint: R0402
R3016 = RES: 0201,1K,+/-1%; Part Reference: R3016; CLASS: DISCRETE; VOLTAGE: 1/16W; FPLIST: RC0402_25,RC0402_HD,RC0402_X2,0402_CC; CAD_APPROVED: Yes; MFG_PN01: RC-01W1001FT; MFG_NAME01: FENGHUA; Tolerance: 5%; Value: 1K; ROHS: Yes; HEIGHT: 0.45 MM; PCB Footprint: R0201
R3055 = RES: 0201,10K,+/-5%; Part Reference: R3055; CLASS: DISCRETE; MFG_NAME01: FENGHUA; MFG_PN01: RC-01W103JT; CAD_APPROVED: Yes; FPLIST: RC0402_25,RC0402_HD,0402_CC; Value: 10K; ROHS: Yes; HEIGHT: 0.4 MM; PCB Footprint: R0201
R3056 = RES: 0201,0Ohm,+/-5%; Part Reference: R3056; CLASS: DISCRETE; VOLTAGE: 1/16W; FPLIST: RC0402_25,RC0402_HD,RC0402_X2,0402_CC; CAD_APPROVED: Yes; MFG_PN01: RC-01000JT; MFG_NAME01: FENGHUA; Tolerance: 5%; Value: 0R; ROHS: Yes; HEIGHT: 0.45 MM; PCB Footprint: R0201
R3059 = RES: 0201,10K,+/-5%; Part Reference: R3059; CLASS: DISCRETE; MFG_NAME01: FENGHUA; MFG_PN01: RC-01W103JT; CAD_APPROVED: Yes; FPLIST: RC0402_25,RC0402_HD,0402_CC; Value: 10K; ROHS: Yes; HEIGHT: 0.4 MM; PCB Footprint: R0201
R3060 = RES: 0201,10K,+/-5%; Part Reference: R3060; CLASS: DISCRETE; MFG_NAME01: FENGHUA; MFG_PN01: RC-01W103JT; CAD_APPROVED: Yes; FPLIST: RC0402_25,RC0402_HD,0402_CC; Value: 10K; ROHS: Yes; HEIGHT: 0.4 MM; PCB Footprint: R0201
TP1047 = T POINT R: no part to order; Part Reference: TP1047; CLASS: IC; CAD_APPROVED: Yes; MFG_NAME01: NOT A COMPONENT; HEIGHT: 0.1MM; ROHS: Yes; MFG_PN01: NOT A COMPONENT; PCB Footprint: tpad_020
TP1048 = T POINT R: no part to order; Part Reference: TP1048; CLASS: IC; MFG_PN01: NOT A COMPONENT; CAD_APPROVED: Yes; MFG_NAME01: NOT A COMPONENT; ROHS: Yes; HEIGHT: 0.1MM; PCB Footprint: tpad_020
U732 = CW3301_Load Switch: SGM2575AD,WLCSP_4B,0.8*0.8mm,-40~85+C; Part Reference: U732; MFG_NAME01: SGMICRO; option: /TCS9719; PCB Footprint: WLCSP_0_8_4B; Value: SGM2575; MFG_PN01: SGM2575
U733 = SGM2526_2: SGM2526YTD10G/TR,TDFN-3x3-10L,-40+C~85+C,Imax 5A; Part Reference: U733; MFG_NAME01: SGMICRO; Value: SGM2526; MFG_PN01: SGM2526; PCB Footprint: tdfn_3x3_10l